# EAGLE schematic untitled (EAGLE 6.6.0)

## Sheet 1 of 4
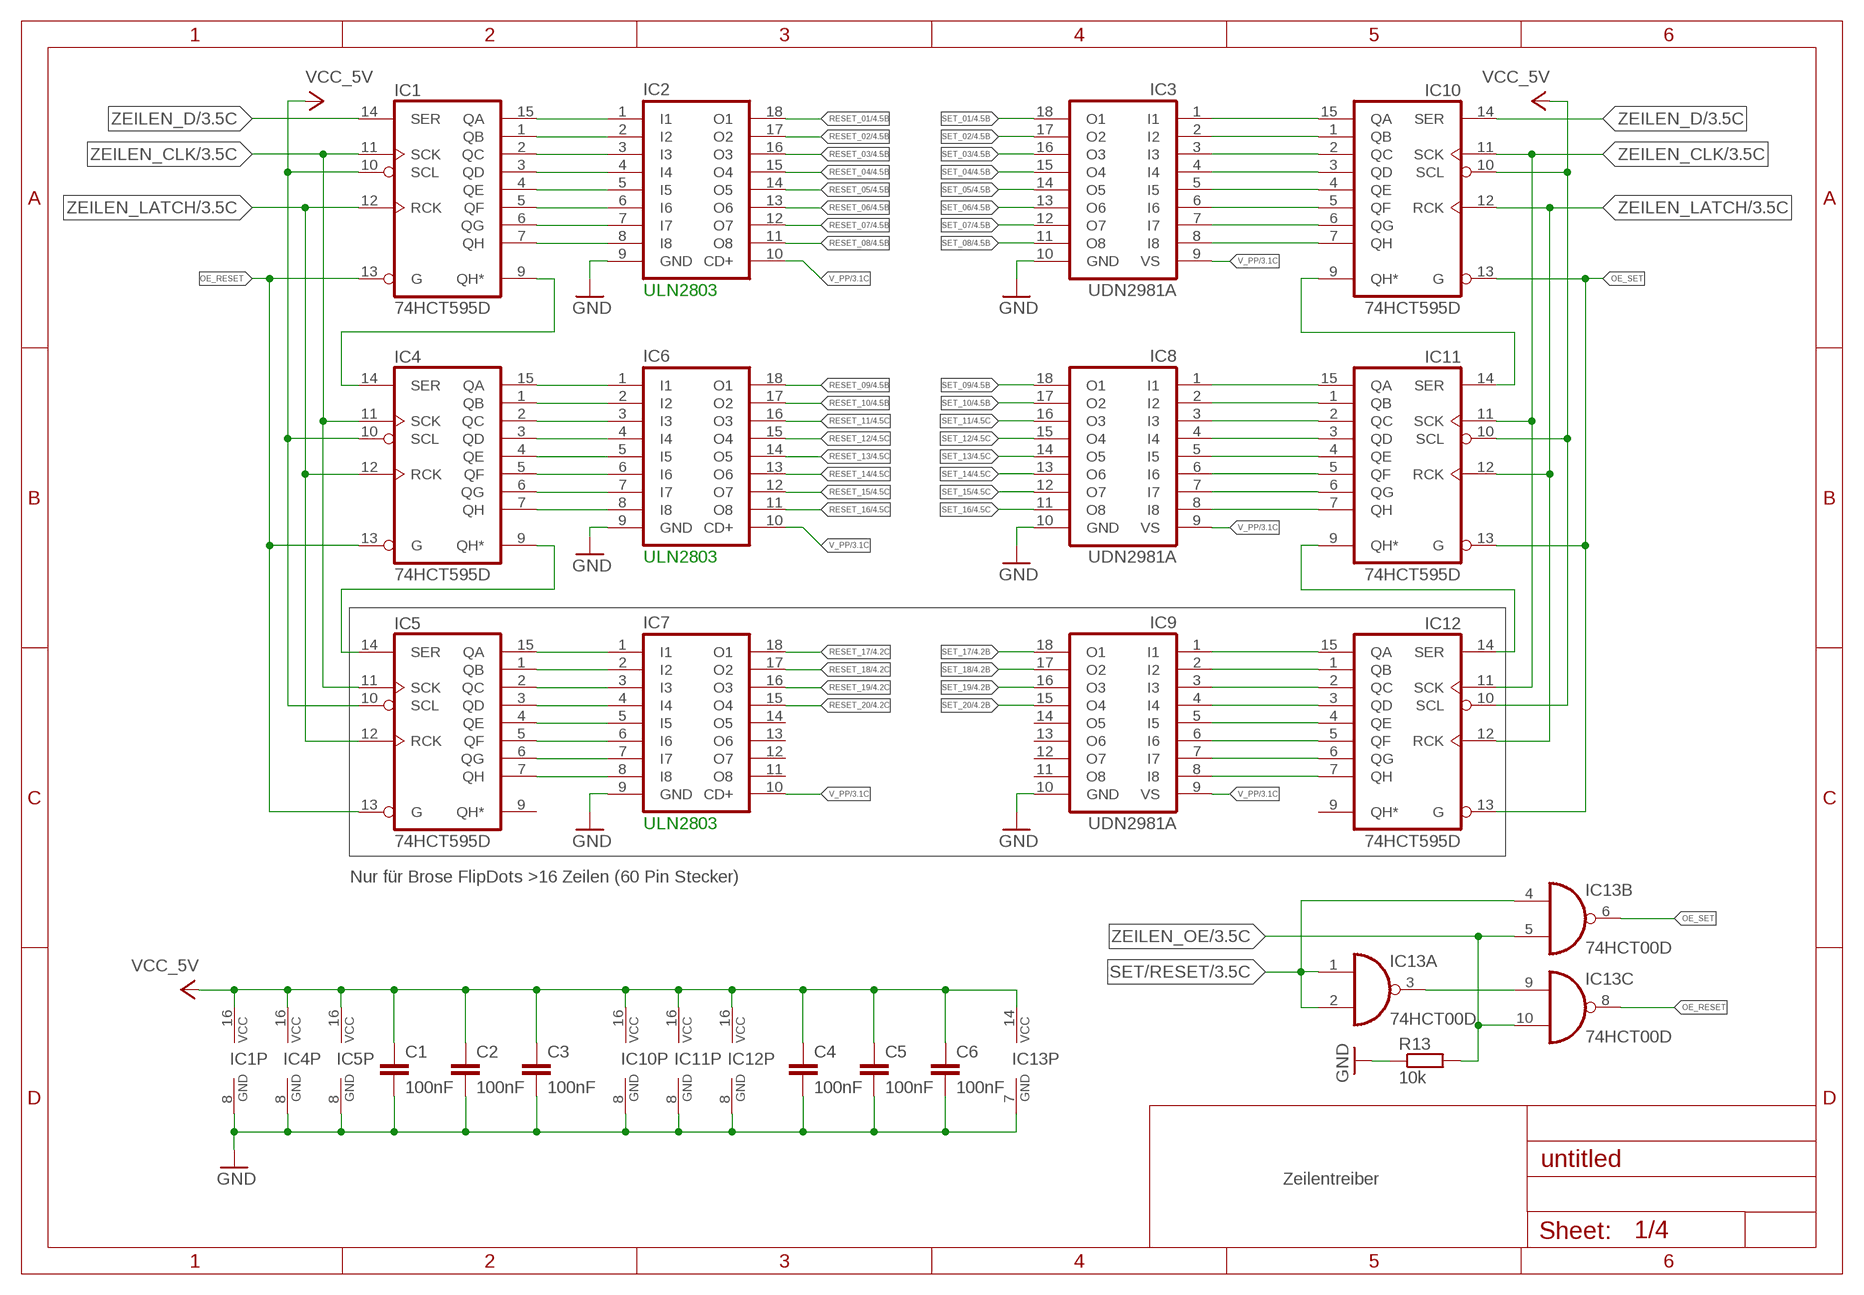
[diagram p0: schematic, sheet 1]

### Parts
C1  100nF  C-EUC1206K  [C1206K]
C2  100nF  C-EUC1206K  [C1206K]
C3  100nF  C-EUC1206K  [C1206K]
C4  100nF  C-EUC1206K  [C1206K]
C5  100nF  C-EUC1206K  [C1206K]
C6  100nF  C-EUC1206K  [C1206K]
IC1  74HCT595D  [SO16]
IC2  ULN2803A  [DIL18]
IC3  UDN2981A  [DIL18]
IC4  74HCT595D  [SO16]
IC5  74HCT595D  [SO16]
IC6  ULN2803A  [DIL18]
IC7  ULN2803A  [DIL18]
IC8  UDN2981A  [DIL18]
IC9  UDN2981A  [DIL18]
IC10  74HCT595D  [SO16]
IC11  74HCT595D  [SO16]
IC12  74HCT595D  [SO16]
IC13  74HCT00D  [SO14]
R13  10k  R-EU_R0805  [R0805]

### Nets
GND: C1.2 C2.2 C3.2 C4.2 C5.2 C6.2 IC1.8(GND) IC2.9(GND) IC3.10(GND) IC4.8(GND) IC5.8(GND) IC6.9(GND) IC7.9(GND) IC8.10(GND) IC9.10(GND) IC10.8(GND) IC11.8(GND) IC12.8(GND) IC13.7(P:GND) R13.1 ; also sheet 2,3,4
N$1: IC1.9(QH*) IC4.14(SER)
N$2: IC4.9(QH*) IC5.14(SER)
N$3: IC4.15(QA) IC6.1(I1)
N$4: IC4.1(QB) IC6.2(I2)
N$5: IC4.2(QC) IC6.3(I3)
N$6: IC4.3(QD) IC6.4(I4)
N$7: IC4.4(QE) IC6.5(I5)
N$8: IC4.5(QF) IC6.6(I6)
N$9: IC4.6(QG) IC6.7(I7)
N$10: IC4.7(QH) IC6.8(I8)
N$11: IC1.15(QA) IC2.1(I1)
N$12: IC1.1(QB) IC2.2(I2)
N$13: IC1.2(QC) IC2.3(I3)
N$14: IC1.3(QD) IC2.4(I4)
N$15: IC1.4(QE) IC2.5(I5)
N$16: IC1.5(QF) IC2.6(I6)
N$17: IC1.6(QG) IC2.7(I7)
N$18: IC1.7(QH) IC2.8(I8)
N$19: IC5.15(QA) IC7.1(I1)
N$20: IC5.1(QB) IC7.2(I2)
N$21: IC5.2(QC) IC7.3(I3)
N$22: IC5.3(QD) IC7.4(I4)
N$23: IC5.4(QE) IC7.5(I5)
N$24: IC5.5(QF) IC7.6(I6)
N$25: IC5.6(QG) IC7.7(I7)
N$26: IC5.7(QH) IC7.8(I8)
N$27: IC3.2(I2) IC10.1(QB)
N$28: IC3.3(I3) IC10.2(QC)
N$29: IC3.4(I4) IC10.3(QD)
N$30: IC3.5(I5) IC10.4(QE)
N$31: IC3.6(I6) IC10.5(QF)
N$32: IC3.7(I7) IC10.6(QG)
N$33: IC3.8(I8) IC10.7(QH)
N$34: IC3.1(I1) IC10.15(QA)
N$35: IC8.2(I2) IC11.1(QB)
N$36: IC8.3(I3) IC11.2(QC)
N$37: IC8.4(I4) IC11.3(QD)
N$38: IC8.5(I5) IC11.4(QE)
N$39: IC8.6(I6) IC11.5(QF)
N$40: IC8.7(I7) IC11.6(QG)
N$41: IC8.8(I8) IC11.7(QH)
N$42: IC8.1(I1) IC11.15(QA)
N$43: IC9.2(I2) IC12.1(QB)
N$44: IC9.3(I3) IC12.2(QC)
N$45: IC9.4(I4) IC12.3(QD)
N$46: IC9.5(I5) IC12.4(QE)
N$47: IC9.6(I6) IC12.5(QF)
N$48: IC9.7(I7) IC12.6(QG)
N$49: IC9.8(I8) IC12.7(QH)
N$50: IC9.1(I1) IC12.15(QA)
N$51: IC10.9(QH*) IC11.14(SER)
N$52: IC11.9(QH*) IC12.14(SER)
N$93: IC13.3(A:O) IC13.9(C:I0)
OE_RESET: IC1.13(G) IC4.13(G) IC5.13(G) IC13.8(C:O)
OE_SET: IC10.13(G) IC11.13(G) IC12.13(G) IC13.6(B:O)
RESET_01: IC2.18(O1) ; also sheet 4
RESET_02: IC2.17(O2) ; also sheet 4
RESET_03: IC2.16(O3) ; also sheet 4
RESET_04: IC2.15(O4) ; also sheet 4
RESET_05: IC2.14(O5) ; also sheet 4
RESET_06: IC2.13(O6) ; also sheet 4
RESET_07: IC2.12(O7) ; also sheet 4
RESET_08: IC2.11(O8) ; also sheet 4
RESET_09: IC6.18(O1) ; also sheet 4
RESET_10: IC6.17(O2) ; also sheet 4
RESET_11: IC6.16(O3) ; also sheet 4
RESET_12: IC6.15(O4) ; also sheet 4
RESET_13: IC6.14(O5) ; also sheet 4
RESET_14: IC6.13(O6) ; also sheet 4
RESET_15: IC6.12(O7) ; also sheet 4
RESET_16: IC6.11(O8) ; also sheet 4
RESET_17: IC7.18(O1) ; also sheet 4
RESET_18: IC7.17(O2) ; also sheet 4
RESET_19: IC7.16(O3) ; also sheet 4
RESET_20: IC7.15(O4) ; also sheet 4
SET/RESET: IC13.1(A:I0) IC13.2(A:I1) IC13.4(B:I0) ; also sheet 3
SET_01: IC3.18(O1) ; also sheet 4
SET_02: IC3.17(O2) ; also sheet 4
SET_03: IC3.16(O3) ; also sheet 4
SET_04: IC3.15(O4) ; also sheet 4
SET_05: IC3.14(O5) ; also sheet 4
SET_06: IC3.13(O6) ; also sheet 4
SET_07: IC3.12(O7) ; also sheet 4
SET_08: IC3.11(O8) ; also sheet 4
SET_09: IC8.18(O1) ; also sheet 4
SET_10: IC8.17(O2) ; also sheet 4
SET_11: IC8.16(O3) ; also sheet 4
SET_12: IC8.15(O4) ; also sheet 4
SET_13: IC8.14(O5) ; also sheet 4
SET_14: IC8.13(O6) ; also sheet 4
SET_15: IC8.12(O7) ; also sheet 4
SET_16: IC8.11(O8) ; also sheet 4
SET_17: IC9.18(O1) ; also sheet 4
SET_18: IC9.17(O2) ; also sheet 4
SET_19: IC9.16(O3) ; also sheet 4
SET_20: IC9.15(O4) ; also sheet 4
V_PP: IC2.10(CD+) IC3.9(VS) IC6.10(CD+) IC7.10(CD+) IC8.9(VS) IC9.9(VS) ; also sheet 3,4
VCC: C1.1 C2.1 C3.1 C4.1 C5.1 C6.1 IC1.10(SCL) IC1.16(VCC) IC4.10(SCL) IC4.16(VCC) IC5.10(SCL) IC5.16(VCC) IC10.10(SCL) IC10.16(VCC) IC11.10(SCL) IC11.16(VCC) IC12.10(SCL) IC12.16(VCC) IC13.14(P:VCC) ; supply symbol labelled VCC_5V ; also sheet 2,3,4
ZEILEN_CLK: IC1.11(SCK) IC4.11(SCK) IC5.11(SCK) IC10.11(SCK) IC11.11(SCK) IC12.11(SCK) ; also sheet 3
ZEILEN_D: IC1.14(SER) IC10.14(SER) ; also sheet 3
ZEILEN_LATCH: IC1.12(RCK) IC4.12(RCK) IC5.12(RCK) IC10.12(RCK) IC11.12(RCK) IC12.12(RCK) ; also sheet 3
ZEILEN_OE: IC13.5(B:I1) IC13.10(C:I1) R13.2 ; also sheet 3
Unconnected: IC5.9(QH*) IC7.11(O8) IC7.12(O7) IC7.13(O6) IC7.14(O5) IC9.11(O8) IC9.12(O7) IC9.13(O6) IC9.14(O5) IC12.9(QH*) IC13.11(D:O) IC13.12(D:I0) IC13.13(D:I1)

### Notes on the sheet
- ULN2803
- ULN2803
- ULN2803
- Nur für Brose FlipDots >16 Zeilen (60 Pin Stecker)
- Zeilentreiber

## Sheet 2 of 4
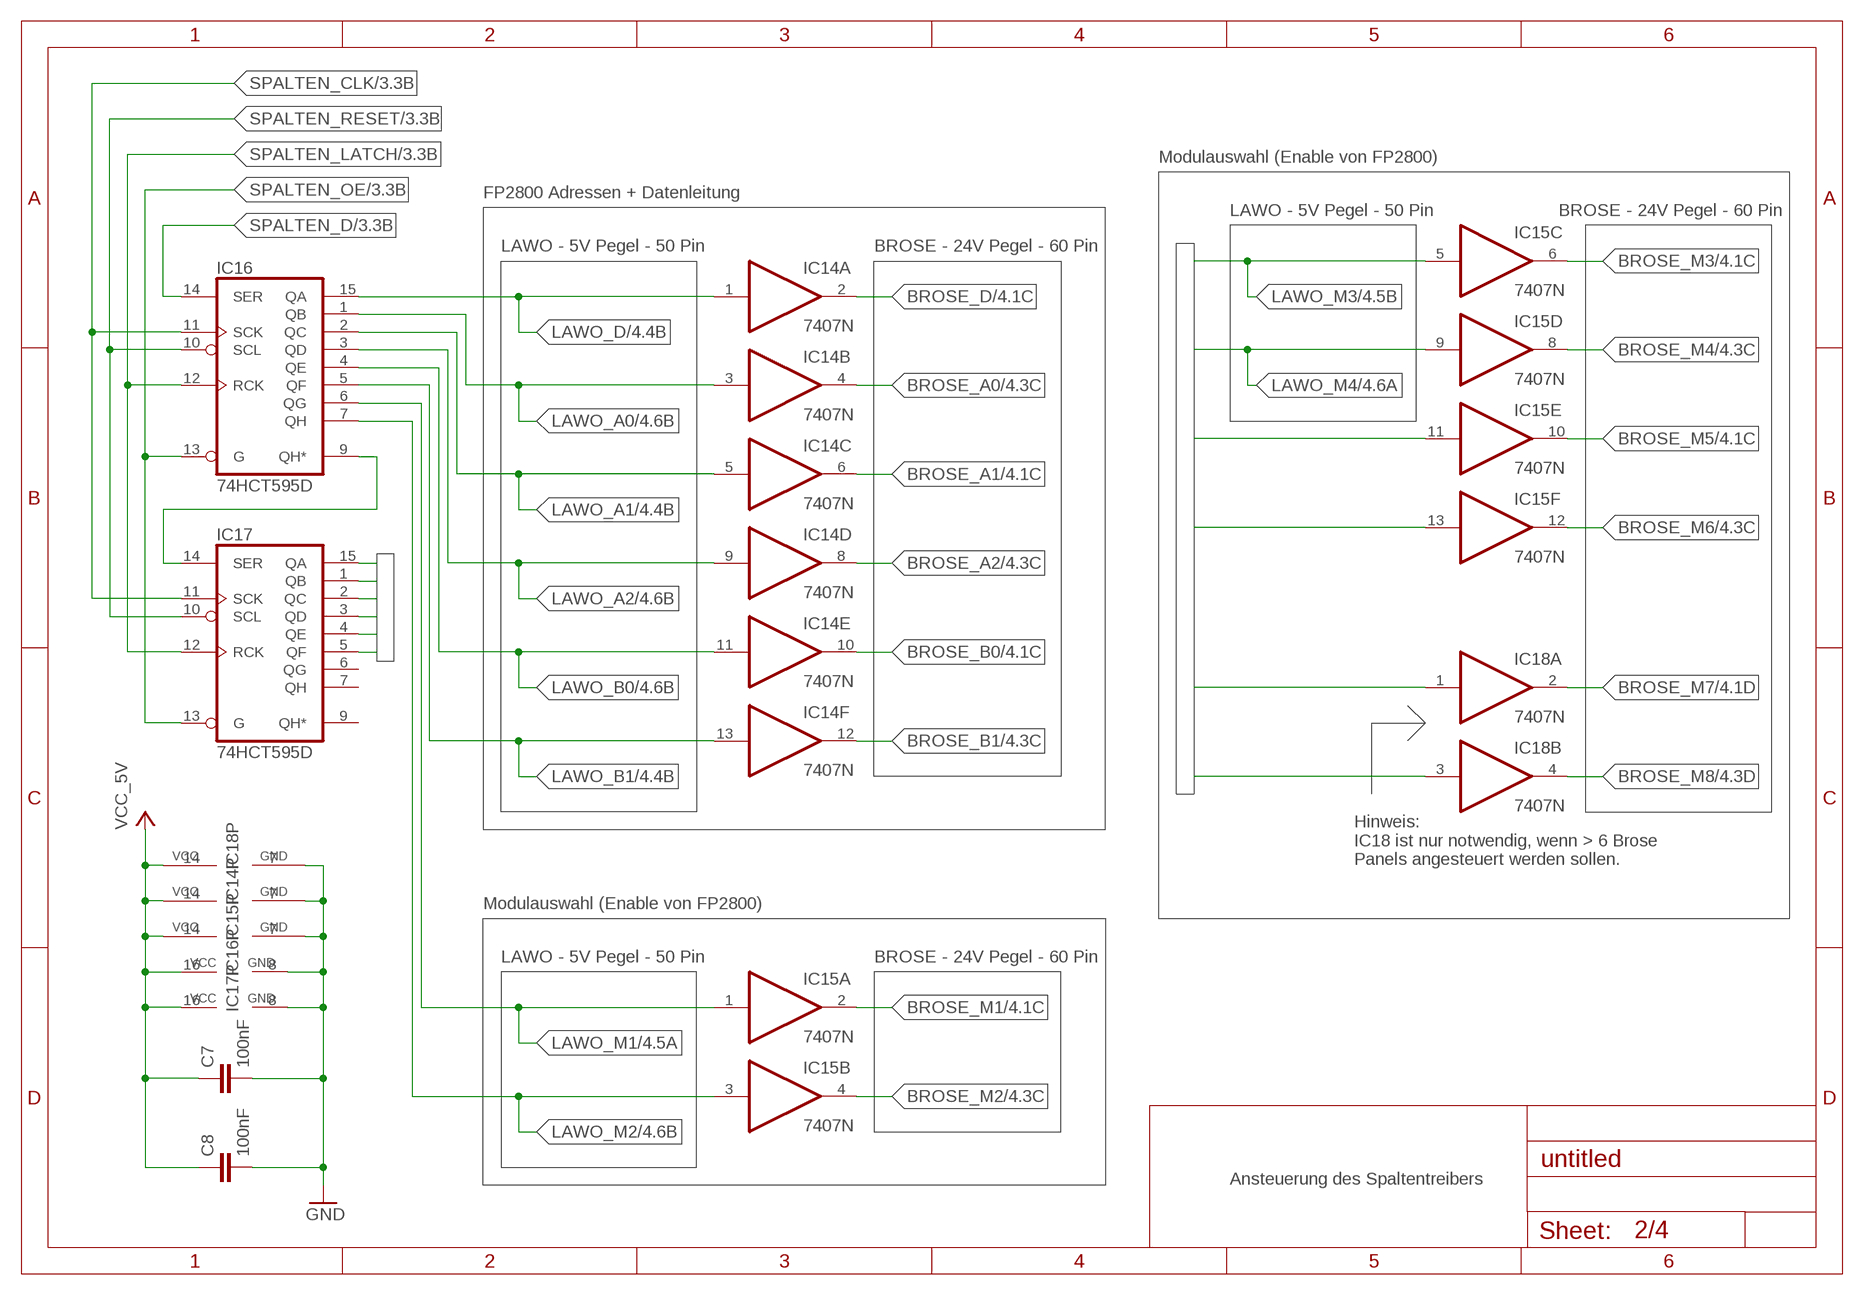
[diagram p1: schematic, sheet 2]

### Parts
C7  100nF  C-EUC1206K  [C1206K]
C8  100nF  C-EUC1206K  [C1206K]
IC14  7407N  [DIL14]
IC15  7407N  [DIL14]
IC16  74HCT595D  [SO16]
IC17  74HCT595D  [SO16]
IC18  7407N  [DIL14]

### Nets
BROSE_A0: IC14.4(B:O) ; also sheet 4
BROSE_A1: IC14.6(C:O) ; also sheet 4
BROSE_A2: IC14.8(D:O) ; also sheet 4
BROSE_B0: IC14.10(E:O) ; also sheet 4
BROSE_B1: IC14.12(F:O) ; also sheet 4
BROSE_D: IC14.2(A:O) ; also sheet 4
BROSE_M1: IC15.2(A:O) ; also sheet 4
BROSE_M2: IC15.4(B:O) ; also sheet 4
BROSE_M3: IC15.6(C:O) ; also sheet 4
BROSE_M4: IC15.8(D:O) ; also sheet 4
BROSE_M5: IC15.10(E:O) ; also sheet 4
BROSE_M6: IC15.12(F:O) ; also sheet 4
BROSE_M7: IC18.2(A:O) ; also sheet 4
BROSE_M8: IC18.4(B:O) ; also sheet 4
GND: C7.2 C8.2 IC14.7(P:GND) IC15.7(P:GND) IC16.8(GND) IC17.8(GND) IC18.7(P:GND) ; also sheet 1,3,4
LAWO_A0: IC14.3(B:I) IC16.1(QB) ; also sheet 4
LAWO_A1: IC14.5(C:I) IC16.2(QC) ; also sheet 4
LAWO_A2: IC14.9(D:I) IC16.3(QD) ; also sheet 4
LAWO_B0: IC14.11(E:I) IC16.4(QE) ; also sheet 4
LAWO_B1: IC14.13(F:I) IC16.5(QF) ; also sheet 4
LAWO_D: IC14.1(A:I) IC16.15(QA) ; also sheet 4
LAWO_M1: IC15.1(A:I) IC16.6(QG) ; also sheet 4
LAWO_M2: IC15.3(B:I) IC16.7(QH) ; also sheet 4
LAWO_M3: IC15.5(C:I) IC17.15(QA) ; also sheet 4
LAWO_M4: IC15.9(D:I) IC17.1(QB) ; also sheet 4
LAWO_M5: IC15.11(E:I) IC17.2(QC)
LAWO_M6: IC15.13(F:I) IC17.3(QD)
LAWO_M7: IC17.4(QE) IC18.1(A:I)
LAWO_M8: IC17.5(QF) IC18.3(B:I)
N$94: IC16.9(QH*) IC17.14(SER)
SPALTEN_CLK: IC16.11(SCK) IC17.11(SCK) ; also sheet 3
SPALTEN_D: IC16.14(SER) ; also sheet 3
SPALTEN_LATCH: IC16.12(RCK) IC17.12(RCK) ; also sheet 3
SPALTEN_OE: IC16.13(G) IC17.13(G) ; also sheet 3
SPALTEN_RESET: IC16.10(SCL) IC17.10(SCL) ; also sheet 3
VCC: C7.1 C8.1 IC14.14(P:VCC) IC15.14(P:VCC) IC16.16(VCC) IC17.16(VCC) IC18.14(P:VCC) ; supply symbol labelled VCC_5V ; also sheet 1,3,4
Unconnected: IC17.6(QG) IC17.7(QH) IC17.9(QH*) IC18.5(C:I) IC18.6(C:O) IC18.8(D:O) IC18.9(D:I) IC18.10(E:O) IC18.11(E:I) IC18.12(F:O) IC18.13(F:I)

### Notes on the sheet
- Modulauswahl (Enable von FP2800)
- FP2800 Adressen + Datenleitung
- LAWO - 5V Pegel - 50 Pin | BROSE - 24V Pegel - 60 Pin
- LAWO - 5V Pegel - 50 Pin | BROSE - 24V Pegel - 60 Pin
- Hinweis:
  IC18 ist nur notwendig, wenn > 6 Brose
  Panels angesteuert werden sollen.
- Modulauswahl (Enable von FP2800)
- LAWO - 5V Pegel - 50 Pin | BROSE - 24V Pegel - 60 Pin
- Ansteuerung des Spaltentreibers

## Sheet 3 of 4
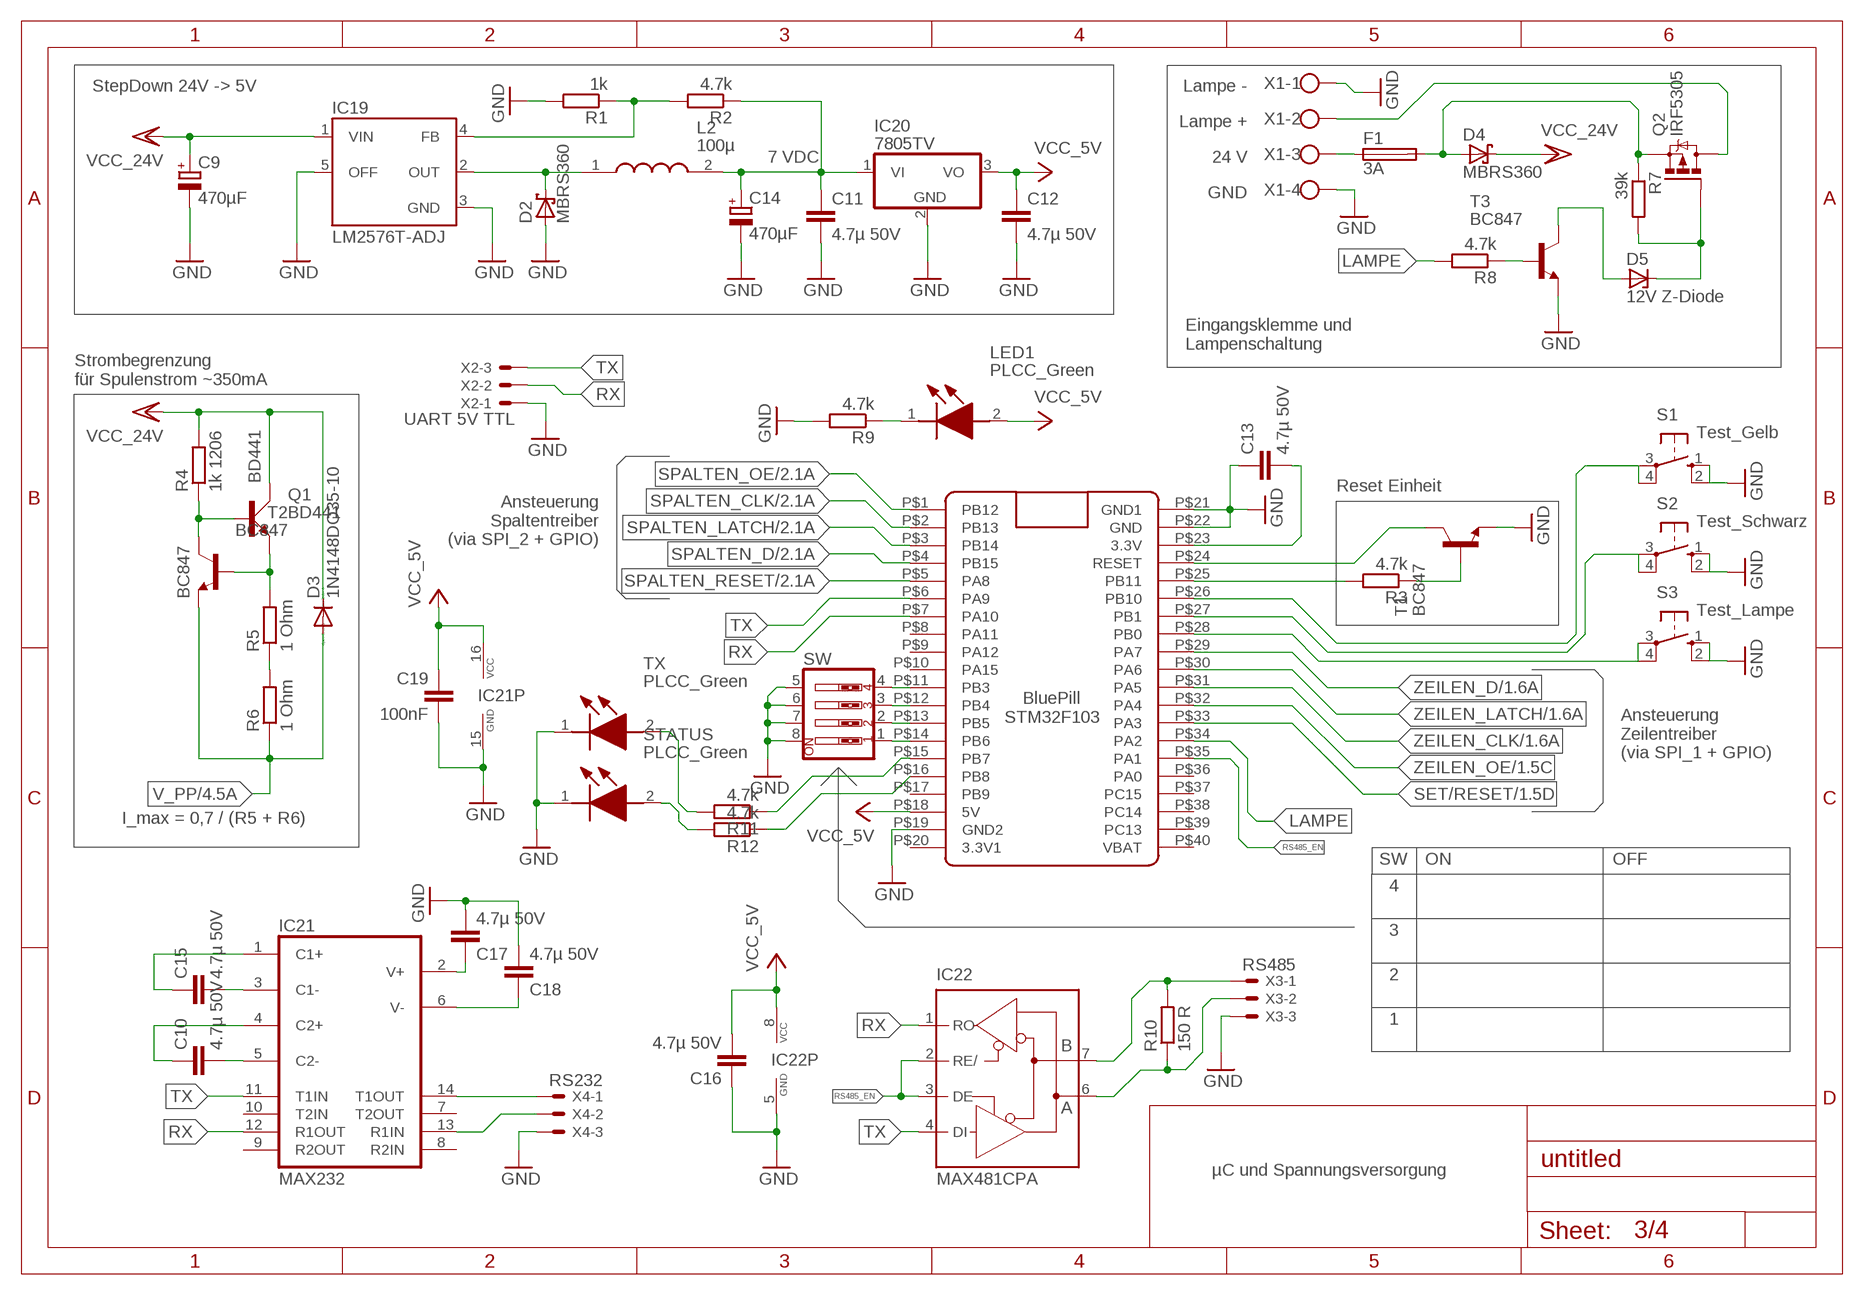
[diagram p2: schematic, sheet 3]

### Parts
C9  470µF  CPOL-EUE5-10.5  [E5-10,5]
C10  4.7µ 50V  C-EUC1210K  [C1210K]
C11  4.7µ 50V  C-EUC1210K  [C1210K]
C12  4.7µ 50V  C-EUC1210K  [C1210K]
C13  4.7µ 50V  C-EUC1210K  [C1210K]
C14  470µF  CPOL-EUE5-10.5  [E5-10,5]
C15  4.7µ 50V  C-EUC1210K  [C1210K]
C16  4.7µ 50V  C-EUC1210K  [C1210K]
C17  4.7µ 50V  C-EUC1210K  [C1210K]
C18  4.7µ 50V  C-EUC1210K  [C1210K]
C19  100nF  C-EUC1206K  [C1206K]
D2  MBRS360  MBRS340T3  [SMC]
D3  1N4148DO35-10  [DO35-10]
D4  MBRS360  MBRS340T3  [SMC]
D5  12V Z-Diode  ZENER-DIODESOD80C  [SOD80C]
F1  3A  SH22,5  [SH22,5]
IC19  LM2576T-ADJ  LM2576T  [TO220-5]
IC20  7805TV  [TO220V]
IC21  MAX232  [DIL16]
IC22  MAX481CPA  [DIL08]
L2  100µ  09HCP-121M-50  [09HCP121M50]
LED1  PLCC_Green  LTST-T680TGWT  [LEDM3528X190N]
Q1  BD441  BD437  [TO126AV]
Q2  IRF5305  IRF9530  [TO220BV]
R1  1k  R-EU_R0805  [R0805]
R2  4.7k  R-EU_R0805  [R0805]
R3  4.7k  R-EU_R0805  [R0805]
R4  1k 1206  R-EU_R1206  [R1206]
R5  1 Ohm  R-EU_M1206  [M1206]
R6  1 Ohm  R-EU_M1206  [M1206]
R7  39k  R-EU_R0805  [R0805]
R8  4.7k  R-EU_R0805  [R0805]
R9  4.7k  R-EU_R0805  [R0805]
R10  150 R  R-EU_R1206  [R1206]
R11  4.7k  R-EU_R0805  [R0805]
R12  4.7k  R-EU_R0805  [R0805]
S1  Test_Gelb  10-XX  [B3F-10XX]
S2  Test_Schwarz  10-XX  [B3F-10XX]
S3  Test_Lampe  10-XX  [B3F-10XX]
STATUS  PLCC_Green  LTST-T680TGWT  [LEDM3528X190N]
SW  SW_DIP-4  [EDG-04]
T1  BC847  [SOT23]
T2  BC847  [SOT23]
T3  BC847  [SOT23]
TX  PLCC_Green  LTST-T680TGWT  [LEDM3528X190N]
U$1  BLUE_PILL  [BLUE_PILL]
X1  W237-4  [W237-4]
X2  UART 5V TTL  22-23-2031  [22-23-2031]
X3  RS485  22-23-2031  [22-23-2031]
X4  RS232  22-23-2031  [22-23-2031]

### Nets
GND: C9.- C11.2 C12.2 C13.1 C14.- C16.1 C17.2 C18.2 C19.2 D2.A IC19.3(GND) IC19.5(OFF) IC20.2(GND) IC21.15(GND) IC22.5(GND) R1.2 R9.2 S1.1(S) S1.2(S1) S2.1(S) S2.2(S1) S3.1(S) S3.2(S1) STATUS.1(K) SW.5 SW.6 SW.7 SW.8 T1.2(E) T3.2(E) TX.1(K) U$1.P$19(GND2) U$1.P$21(GND1) U$1.P$22(GND) X1.1 X1.4 X2.1 X3.3 X4.3 ; also sheet 1,2,4
LAMPE: R8.2 U$1.P$34(PA2)
N$53: R5.1 R6.2
N$54: D5.A T3.3(C)
N$55: F1.1 X1.3
N$56: D5.C Q2.G R7.2
N$57: D4.A F1.2 Q2.S R7.1
N$58: R8.1 T3.1(B)
N$59: SW.1 U$1.P$14(PB6)
N$60: SW.2 U$1.P$13(PB5)
N$61: SW.3 U$1.P$12(PB4)
N$62: SW.4 U$1.P$11(PB3)
N$63: LED1.1(K) R9.1
N$64: IC22.6(A) R10.1 X3.2
N$65: IC22.7(B) R10.2 X3.1
N$66: C10.2 IC21.5(C2-)
N$67: C10.1 IC21.4(C2+)
N$68: IC21.14(T1OUT) X4.1
N$69: C15.2 IC21.3(C1-)
N$70: C15.1 IC21.1(C1+)
N$71: IC21.13(R1IN) X4.2
N$72: C17.1 IC21.2(V+)
N$73: C18.1 IC21.6(V-)
N$74: Q2.D X1.2
N$75: R11.1 U$1.P$15(PB7)
N$76: R12.1 U$1.P$16(PB8)
N$77: R12.2 STATUS.2(A)
N$78: R11.2 TX.2(A)
N$95: C11.1 C14.+ IC20.1(VI) L2.2 R2.1
N$96: D2.C IC19.2(OUT) L2.1
N$97: IC19.4(FB) R1.1 R2.2
N$98: R3.1 T1.1(B)
N$99: T1.3(C) U$1.P$24(RESET)
N$100: R3.2 U$1.P$25(PB11)
N$134: Q1.B R4.1 T2.3(C)
N$136: Q1.E R5.2 T2.1(B)
N$139: S2.3(P) S2.4(P1) U$1.P$27(PB1)
N$140: S1.3(P) S1.4(P1) U$1.P$26(PB10)
N$141: S3.3(P) S3.4(P1) U$1.P$28(PB0)
N$143: C13.2 U$1.P$23(3.3V)
RS485_EN: IC22.2(RE/) IC22.3(DE) U$1.P$35(PA1)
RX: IC21.12(R1OUT) IC22.1(RO) U$1.P$7(PA10) X2.2
SET/RESET: U$1.P$33(PA3) ; also sheet 1
SPALTEN_CLK: U$1.P$2(PB13) ; also sheet 2
SPALTEN_D: U$1.P$4(PB15) ; also sheet 2
SPALTEN_LATCH: U$1.P$3(PB14) ; also sheet 2
SPALTEN_OE: U$1.P$1(PB12) ; also sheet 2
SPALTEN_RESET: U$1.P$5(PA8) ; also sheet 2
TX: IC21.11(T1IN) IC22.4(DI) U$1.P$6(PA9) X2.3
V_PP: D3.A R6.1 T2.2(E) ; also sheet 1,4
VCC: C12.1 C16.2 C19.1 IC20.3(VO) IC21.16(VCC) IC22.8(VCC) LED1.2(A) U$1.P$18(5V) ; supply symbol labelled VCC_5V ; also sheet 1,2,4
VCC/2: C9.+ D3.C D4.C IC19.1(VIN) Q1.C R4.2 ; supply symbol labelled VCC_24V ; also sheet 4
ZEILEN_CLK: U$1.P$31(PA5) ; also sheet 1
ZEILEN_D: U$1.P$29(PA7) ; also sheet 1
ZEILEN_LATCH: U$1.P$30(PA6) ; also sheet 1
ZEILEN_OE: U$1.P$32(PA4) ; also sheet 1
Unconnected: IC21.7(T2OUT) IC21.8(R2IN) IC21.9(R2OUT) IC21.10(T2IN) U$1.P$8(PA11) U$1.P$9(PA12) U$1.P$10(PA15) U$1.P$17(PB9) U$1.P$20(3.3V1) U$1.P$36(PA0) U$1.P$37(PC15) U$1.P$38(PC14) U$1.P$39(PC13) U$1.P$40(VBAT)

### Notes on the sheet
- StepDown 24V -> 5V | Lampe -
- Lampe +
- 7 VDC | 24 V
- GND
- Eingangsklemme und
  Lampenschaltung
- Strombegrenzung
  für Spulenstrom ~350mA
- BD441
- Reset Einheit
- Ansteuerung
  Spaltentreiber
  (via SPI_2 + GPIO)
- BC847
- BluePill
  STM32F103
- Ansteuerung
  Zeilentreiber
  (via SPI_1 + GPIO)
- I_max = 0,7 / (R5 + R6)
- SW | ON | OFF
- 4
- 3
- 2
- 1
- µC und Spannungsversorgung

## Sheet 4 of 4
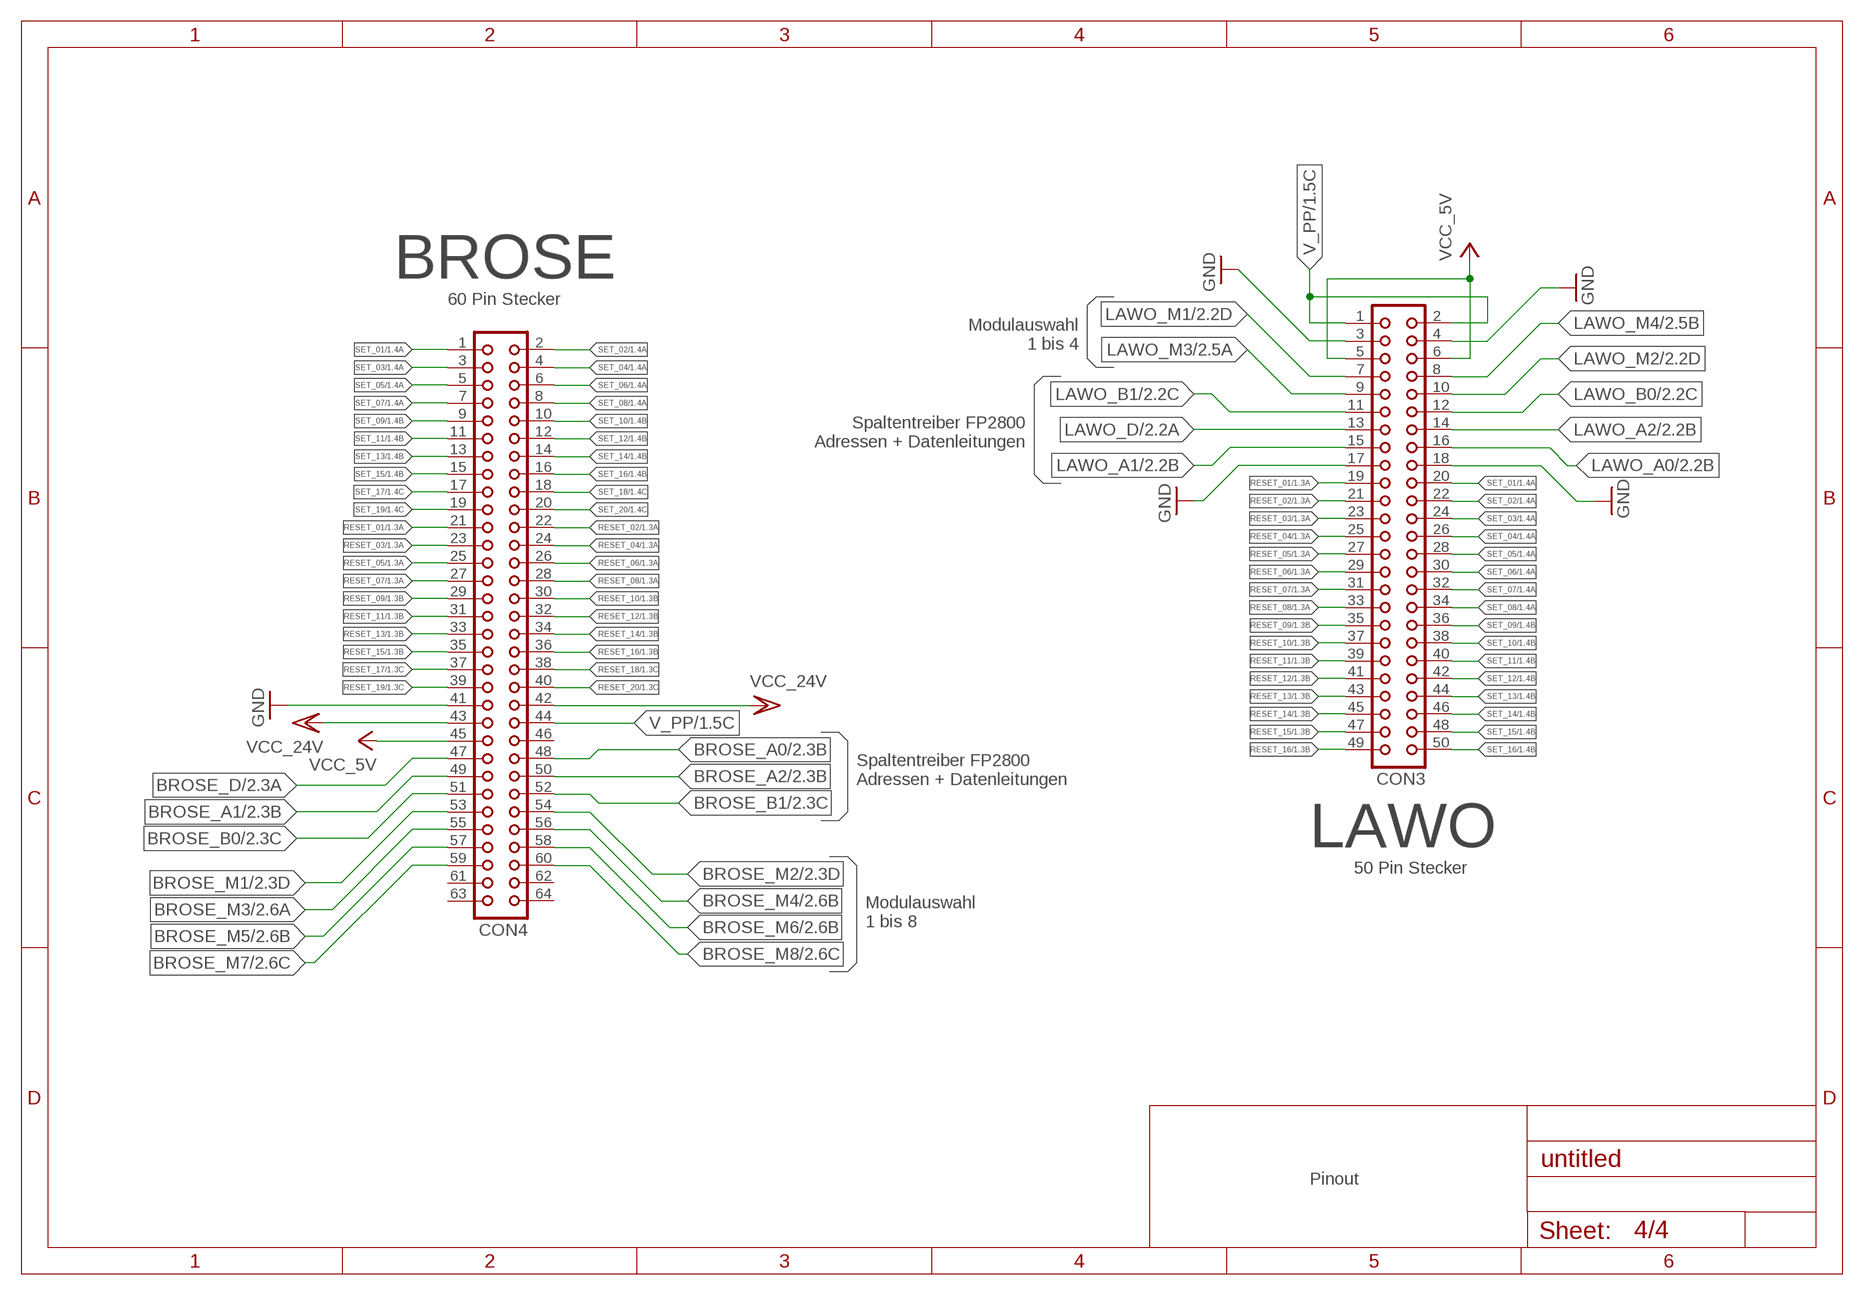
[diagram p3: schematic, sheet 4]

### Parts
CON3  CON50  [CON50]
CON4  CON64  [CON64]

### Nets
BROSE_A0: CON4.48 ; also sheet 2
BROSE_A1: CON4.49 ; also sheet 2
BROSE_A2: CON4.50 ; also sheet 2
BROSE_B0: CON4.51 ; also sheet 2
BROSE_B1: CON4.52 ; also sheet 2
BROSE_D: CON4.47 ; also sheet 2
BROSE_M1: CON4.53 ; also sheet 2
BROSE_M2: CON4.54 ; also sheet 2
BROSE_M3: CON4.55 ; also sheet 2
BROSE_M4: CON4.56 ; also sheet 2
BROSE_M5: CON4.57 ; also sheet 2
BROSE_M6: CON4.58 ; also sheet 2
BROSE_M7: CON4.59 ; also sheet 2
BROSE_M8: CON4.60 ; also sheet 2
GND: CON3.3 CON3.4 CON3.17 CON3.18 CON4.41 ; also sheet 1,2,3
LAWO_A0: CON3.16 ; also sheet 2
LAWO_A1: CON3.15 ; also sheet 2
LAWO_A2: CON3.14 ; also sheet 2
LAWO_B0: CON3.12 ; also sheet 2
LAWO_B1: CON3.11 ; also sheet 2
LAWO_D: CON3.13 ; also sheet 2
LAWO_M1: CON3.7 ; also sheet 2
LAWO_M2: CON3.10 ; also sheet 2
LAWO_M3: CON3.9 ; also sheet 2
LAWO_M4: CON3.8 ; also sheet 2
RESET_01: CON3.19 CON4.21 ; also sheet 1
RESET_02: CON3.21 CON4.22 ; also sheet 1
RESET_03: CON3.23 CON4.23 ; also sheet 1
RESET_04: CON3.25 CON4.24 ; also sheet 1
RESET_05: CON3.27 CON4.25 ; also sheet 1
RESET_06: CON3.29 CON4.26 ; also sheet 1
RESET_07: CON3.31 CON4.27 ; also sheet 1
RESET_08: CON3.33 CON4.28 ; also sheet 1
RESET_09: CON3.35 CON4.29 ; also sheet 1
RESET_10: CON3.37 CON4.30 ; also sheet 1
RESET_11: CON3.39 CON4.31 ; also sheet 1
RESET_12: CON3.41 CON4.32 ; also sheet 1
RESET_13: CON3.43 CON4.33 ; also sheet 1
RESET_14: CON3.45 CON4.34 ; also sheet 1
RESET_15: CON3.47 CON4.35 ; also sheet 1
RESET_16: CON3.49 CON4.36 ; also sheet 1
RESET_17: CON4.37 ; also sheet 1
RESET_18: CON4.38 ; also sheet 1
RESET_19: CON4.39 ; also sheet 1
RESET_20: CON4.40 ; also sheet 1
SET_01: CON3.20 CON4.1 ; also sheet 1
SET_02: CON3.22 CON4.2 ; also sheet 1
SET_03: CON3.24 CON4.3 ; also sheet 1
SET_04: CON3.26 CON4.4 ; also sheet 1
SET_05: CON3.28 CON4.5 ; also sheet 1
SET_06: CON3.30 CON4.6 ; also sheet 1
SET_07: CON3.32 CON4.7 ; also sheet 1
SET_08: CON3.34 CON4.8 ; also sheet 1
SET_09: CON3.36 CON4.9 ; also sheet 1
SET_10: CON3.38 CON4.10 ; also sheet 1
SET_11: CON3.40 CON4.11 ; also sheet 1
SET_12: CON3.42 CON4.12 ; also sheet 1
SET_13: CON3.44 CON4.13 ; also sheet 1
SET_14: CON3.46 CON4.14 ; also sheet 1
SET_15: CON3.48 CON4.15 ; also sheet 1
SET_16: CON3.50 CON4.16 ; also sheet 1
SET_17: CON4.17 ; also sheet 1
SET_18: CON4.18 ; also sheet 1
SET_19: CON4.19 ; also sheet 1
SET_20: CON4.20 ; also sheet 1
V_PP: CON3.1 CON3.2 CON4.44 ; also sheet 1,3
VCC: CON3.5 CON3.6 CON4.45 ; supply symbol labelled VCC_5V ; also sheet 1,2,3
VCC/2: CON4.42 CON4.43 ; supply symbol labelled VCC_24V ; also sheet 3
Unconnected: CON4.46 CON4.61 CON4.62 CON4.63 CON4.64

### Notes on the sheet
- BROSE
- 60 Pin Stecker
- Modulauswahl
  1 bis 4
- Spaltentreiber FP2800
  Adressen + Datenleitungen
- Spaltentreiber FP2800
  Adressen + Datenleitungen
- LAWO
- 50 Pin Stecker
- Modulauswahl
  1 bis 8
- Pinout

## Library data of the parts
C1-C6 C10-C13 C15-C19 = rcl:C-EU: CAPACITOR, European symbol
C7 C8 = resistor:C-EU: CAPACITOR, European symbol
C9 C14 = rcl:CPOL-EU: POLARIZED CAPACITOR, European symbol
CON3 = con-harting:CON50: CONNECTOR; OC_FARNELL: unknown; OC_NEWARK: unknown
CON4 = con-harting:CON64: CONNECTOR; OC_FARNELL: unknown; OC_NEWARK: unknown
D2 D4 = diode:MBRS3*0T3: SCHOTTKY BARRIER RECTIFIER 3.0 AMPERES 20, 30, 40 VOLT Source: MBRS340T3-D.pdf
D3 = diode:1N4148: DIODE high speed (Philips)
D5 = diode:ZENER-DIODE: Z-Diode
F1 = fuse:SH22,5: FUSE HOLDER grid 22,5 mm, OGN0031 8201, Schurter (Buerklin); MF: SCHURTER; MPN: 0031.8201; OC_FARNELL: 1162740; OC_NEWARK: 96F8317
IC1 IC4 IC5 IC10-IC12 IC16 IC17 = 74xx-eu:74*595: 8-bit SHIFT REGISTER, output latch
IC2 IC6 IC7 = uln-udn:ULN2803A: DRIVER ARRAY
IC3 IC8 IC9 = uln-udn:UDN298*: DRIVER ARRAY Source: Allegro Microsystems Inc. / UDN2981-UDN2984.pdf
IC13 = 74xx-eu:74*00: Quad 2-input NAND gate
IC14 IC15 IC18 = 74xx-us:74*07: Hex BUFFER, open collector high-voltage output
IC19 = _v-reg-3:LM2576: National Semiconductor <http://www.national.com> 3.0A "Simple Switcher"(c) 52kHz, Vout 1.23-37V (HV: 57V), Vin 40V (HV: 60V), 50µA standby current
IC20 = linear:78*: Positive VOLTAGE REGULATOR Source: http://cache.national.com/ds/LM/LM78L05.pdf http://www.fairchildsemi.com/ds/LM/LM7805.pdf
IC21 = maxim:MAX232: RS232 TRANSCEIVER; MF: MAXIM; MPN: MAX232ACPE+; OC_FARNELL: 9723773; OC_NEWARK: 68K4544
IC22 = maxim:MAX481CPA: RS485 TRANSEIVER; MPN: MAX481CPA+; OC_FARNELL: unknown; OC_NEWARK: 99K3445
L2 = _09HCP Inductor 100µH:09HCP-121M-50: Fixed Inductors 120uH 20% RF CHOKE High Current Source: Datasheet <http://fastrongroup.com/plugable-inductors-pin-type-coils/09hcp-09hcpt>; DESCRIPTION: Fixed Inductors 120uH 20% RF CHOKE High Current; HEIGHT: 11.5mm; MANUFACTURER_NAME: Fastron; MANUFACTURER_PART_NUMBER: 09HCP-121M-50; MOUSER_PART_NUMBER: 434-09HCP-121M; MOUSER_PRICE-STOCK: https://www.mouser.co.uk/ProductDetail/Fastron/09HCP-121M-50/?qs=igiTrb5Y5PPRTVGVQhpNng%3D%3D
LED1 STATUS TX = _PLCC-2:LTST-T680TGWT: Standard LEDs - SMD SMD PLCC2, 3528, TOP VIEW, InGaN GRN, 525NM, 600MCD, CLR, T/R Source: Datasheet <http://optoelectronics.liteon.com/upload/download/DS22-2013-0345/LTST-T680TGWT.pdf>; DESCRIPTION: Standard LEDs - SMD SMD PLCC2, 3528, TOP VIEW, InGaN GRN, 525NM, 600MCD, CLR, T/R; HEIGHT: 1.9mm; MANUFACTURER_NAME: Lite-On; MANUFACTURER_PART_NUMBER: LTST-T680TGWT; MOUSER_PART_NUMBER: 859-LTST-T680TGWT; MOUSER_PRICE-STOCK: https://www.mouser.co.uk/ProductDetail/Lite-On/LTST-T680TGWT?qs=5Clb0NIqk7GzGmBolxZGgw%3D%3D
Q1 = transistor-power:BD437: NPN TRANSISTOR
Q2 = transistor-power:IRF9530: P-CHANNEL HEXFET POWER-MOS-FET Source: http://www.irf.com/product-info/datasheets/data/irf9530.pdf
R1-R13 = rcl:R-EU_: RESISTOR, European symbol
S1-S3 = switch-omron:10-XX: OMRON SWITCH; MPN: B3F-1000; OC_FARNELL: 176432; OC_NEWARK: 36M3542
SW = special:SW_DIP-4: DIP SWITCH
T1-T3 = transistor:BC847: NPN TRANSISTOR
U$1 = _BluePill:BLUE_PILL
X1 = con-wago-500:W237-4: WAGO SCREW CLAMP; OC_FARNELL: unknown; OC_NEWARK: unknown
X2-X4 = con-molex:22-23-2031: .100" (2.54mm) Center Header - 3 Pin; MF: MOLEX; MPN: 22-23-2031; OC_FARNELL: 1462950; OC_NEWARK: 30C0862